# EasyEDA Pro project Quadrotor_Aircraft.eprj

# Schematic Schematic1
Create Date: 2024-07-05; Page Name: P1; Project Name: Quadrotor_Aircraft; Schematic Name: Schematic1; Update Date: 2024-07-08; Company: 嘉立创EDA; Page Size: A4; Version: V1.0
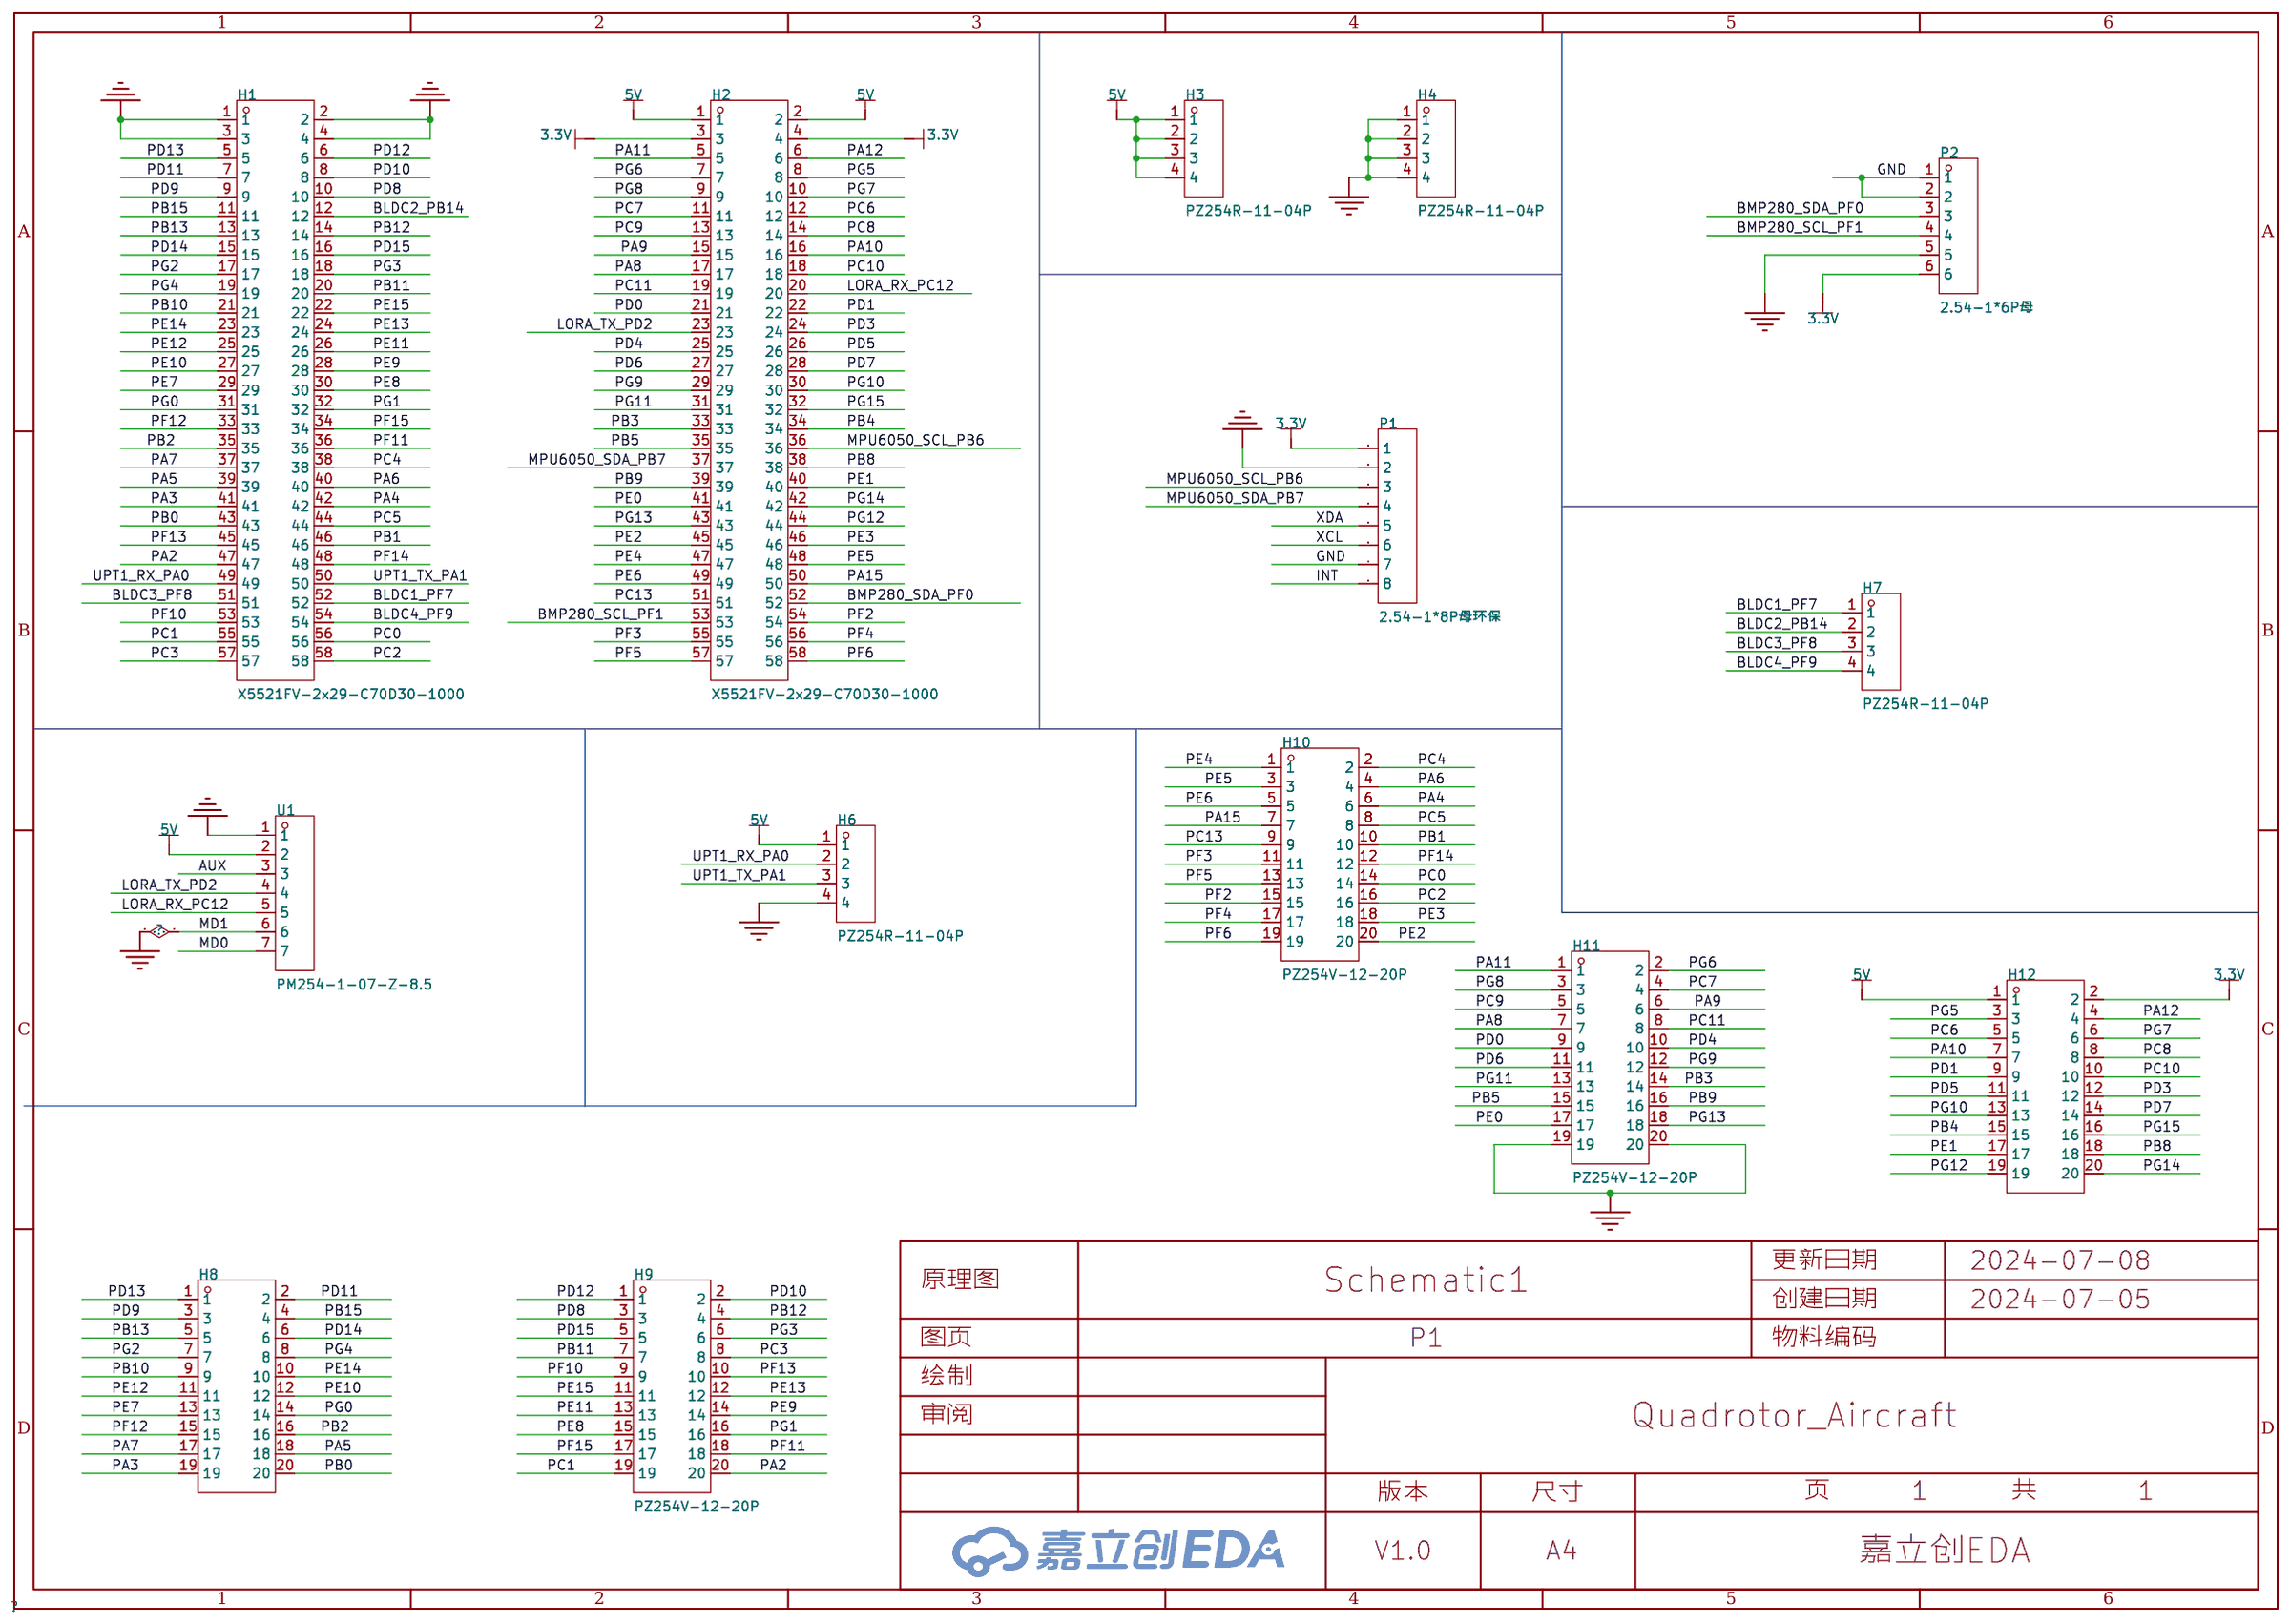
[diagram p0: schematic sheet]

## Parts
H1  X5521FV-2x29-C70D30-1000  [HDR-TH_58P-P2.54-V-F-R2-C29-S2.54]
H2  X5521FV-2x29-C70D30-1000  [HDR-TH_58P-P2.54-V-F-R2-C29-S2.54]
H3  PZ254R-11-04P  [HDR-TH_4P-P2.54-H-M-W10.4]
H4  PZ254R-11-04P  [HDR-TH_4P-P2.54-H-M-W10.4]
H6  PZ254R-11-04P  [HDR-TH_4P-P2.54-H-M-W10.4]
H7  PZ254R-11-04P  [HDR-TH_4P-P2.54-H-M-W10.4]
H8  PZ254V-12-20P  [HDR-TH_20P-P2.54-V-M-R2-C10-S2.54]
H9  PZ254V-12-20P  [HDR-TH_20P-P2.54-V-M-R2-C10-S2.54]
H10  PZ254V-12-20P  [HDR-TH_20P-P2.54-V-M-R2-C10-S2.54]
H11  PZ254V-12-20P  [HDR-TH_20P-P2.54-V-M-R2-C10-S2.54]
H12  PZ254V-12-20P  [HDR-TH_20P-P2.54-V-M-R2-C10-S2.54]
P1  2.54-1*8P母环保  [HDR-TH_8P-P2.54-V-F-1]
P2  2.54-1*6P母  [HDR-TH_6P-P2.54-V-F]
U1  PM254-1-07-Z-8.5  [HDR-TH_7P-P2.54-V-F]

## Library data of the parts
H1 H2 = X5521FV-2x29-C70D30-1000: 插孔结构:2x29P;间距:2.54mm;行距:2.54mm;圆孔/方孔:圆孔;安装类型:直插;排数:双排;总孔位数:58P;额定电流:3A;额定电压:-;插孔方向:顶部;塑高:7mm;触头材质:黄铜;触头镀层:金;工作温度范围:-40℃~+105℃;焊接温度(最大值):260℃;; LCSC Part Name: 间距:2.54mm 2x29P 直插; Supplier Part: C2682213; Manufacturer: XKB Connectivity(中国星坤); Supplier Footprint: 插件,P=2.54mm; JLCPCB Part Class: 扩展库; Datasheet: https://atta.szlcsc.com/upload/public/pdf/source/20210108/C2682197_06F7869BD6CE28D3571C9D5993C38392.pdf; Supplier: LCSC; Holes Structure: 2x29P; Pitch: 2.54mm; Row Spacing: 2.54mm; Circular Hole / Square Hole: 圆孔; Mounting Type: 直插; Number of Rows: 双排; Number of Holes: 58P; Current Rating (Max): 3A; Holes Direction: 顶部; Insulation Height: 7mm; Contact Material: 黄铜; Contact Plating: 金; Operating Temperature Range: -40℃~+105℃; Soldering Temperature(Max): 260℃
H3 H4 H6 H7 = PZ254R-11-04P: 插针结构:1x4P;间距:2.54mm;行距:-;圆针/方针:方针;安装类型:弯插;排数:单排;总PIN位数:4P;额定电流:-;额定电压:-;配合针长度:6mm;塑高:2.5mm;触头材质:黄铜;触头镀层:-;工作温度范围:-40℃~+105℃;颜色:黑色;; LCSC Part Name: 间距:2.54mm 1x4P 弯插 方针; Supplier Part: C492412; Manufacturer: XFCN(兴飞); Supplier Footprint: 弯插,P=2.54mm; JLCPCB Part Class: 扩展库; Datasheet: https://atta.szlcsc.com/upload/public/pdf/source/20200309/C492412_B0EFFC1946AB079B8871416C4A09EF6C.pdf; Supplier: LCSC; Pin Structure: 1x4P; Pitch: 2.54mm; Circluar Pins/Square Pins: 方针; Mounting Type: 弯插; Number of Rows: 单排; Number of Pins: 4P; Length of Mating Pin: 6mm; Insulation Height: 2.5mm; Contact Material: 黄铜; Operating Temperature Range: -40℃~+105℃; Color: 黑色
H8-H12 = PZ254V-12-20P: 插针结构:2x10P;间距:2.54mm;行距:2.54mm;圆针/方针:方针;安装类型:直插;排数:双排;总PIN位数:20P;额定电流:-;额定电压:-;配合针长度:6mm;塑高:2.5mm;端接针长度:3mm;触头材质:黄铜;触头镀层:-;工作温度范围:-40℃~+105℃;颜色:黑色;; LCSC Part Name: 间距:2.54mm 2x10P 直插 方针; Supplier Part: C492427; Manufacturer: XFCN(兴飞); Supplier Footprint: 插件,P=2.54mm; JLCPCB Part Class: 扩展库; Datasheet: https://atta.szlcsc.com/upload/public/pdf/source/20200309/C492427_9411E93D35F2EC20CED9A3ED9F4BBE60.pdf; Supplier: LCSC; Pin Structure: 2x10P; Pitch: 2.54mm; Row Spacing: 2.54mm; Circluar Pins/Square Pins: 方针; Mounting Type: 直插; Number of Rows: 双排; Number of Pins: 20P; Length of Mating Pin: 6mm; Insulation Height: 2.5mm; Length of End Connection Pin: 3mm; Contact Material: 黄铜; Operating Temperature Range: -40℃~+105℃; Color: 黑色
P1 = 2.54-1*8P母环保: 插孔结构:1x8P;间距:2.54mm;行距:-;安装类型:直插;排数:单排;总孔位数:8P;塑高:-;触头材质:-;触头镀层:-;; LCSC Part Name: 间距:2.54mm 1x8P 直插; Supplier Part: C27438; Manufacturer: BOOMELE(博穆精密); Supplier Footprint: 插件,P=2.54mm; JLCPCB Part Class: 扩展库; Datasheet: https://atta.szlcsc.com/upload/public/pdf/source/20231221/1CA800C6799ED97958773716FAA1BFFE.pdf; Supplier: LCSC; Holes Structure: 1x8P; Pitch: 2.54mm; Mounting Type: 直插; Number of Rows: 单排; Number of Holes: 8P
P2 = 2.54-1*6P母: 插孔结构:1x6P;间距:2.54mm;行距:-;安装类型:直插;排数:单排;总孔位数:6P;塑高:-;触头材质:-;触头镀层:-;; LCSC Part Name: 间距:2.54mm 1x6P 直插; Supplier Part: C40877; Manufacturer: BOOMELE(博穆精密); Supplier Footprint: 插件,P=2.54mm; JLCPCB Part Class: 扩展库; Datasheet: https://atta.szlcsc.com/upload/public/pdf/source/20210301/C2718488_F4427B881E42CAA8DDB0B1C12B3A522C.pdf; Supplier: LCSC; Holes Structure: 1x6P; Pitch: 2.54mm; Mounting Type: 直插; Number of Rows: 单排; Number of Holes: 6P
U1 = PM254-1-07-Z-8.5: 插孔结构:1x7P;间距:2.54mm;行距:-;圆孔/方孔:方孔;安装类型:直插;排数:单排;总孔位数:7P;额定电流:3A;额定电压:-;插孔方向:顶部;塑高:8.5mm;触头材质:铜合金;工作温度范围:-40℃~+105℃;焊接温度(最大值):260℃@5S;; LCSC Part Name: 1x7P 间距:2.54mm 直插; Supplier Part: C2897370; Manufacturer: HCTL(华灿天禄); Supplier Footprint: 插件,P=2.54mm; JLCPCB Part Class: 扩展库; Datasheet: https://atta.szlcsc.com/upload/public/pdf/source/20230609/534BE42964C679BDE98E061007C4ABD6.pdf; Supplier: LCSC; Holes Structure: 1x7P; Pitch: 2.54mm; Circular Hole / Square Hole: 方孔; Mounting Type: 直插; Number of Rows: 单排; Number of Holes: 7P; Current Rating (Max): 3A; Holes Direction: 顶部; Insulation Height: 8.5mm; Contact Material: 铜合金; Operating Temperature Range: -40℃~+105℃; Soldering Temperature(Max): 260℃@5S

## Nets
3.3V: H2.3 H2.4 H12.2 P1.1 P2.6
5V: H2.1 H2.2 H3.1 H3.2 H3.3 H3.4 H6.1 H12.1 U1.2
GND: H1.1 H1.2 H1.3 H1.4 H4.1 H4.2 H4.3 H4.4 H6.4 H11.19 H11.20 P1.2 P1.7 P2.1 P2.2 P2.5 U1.1 U1.6
AUX: U1.3
BLDC1_PF7: H1.52 H7.1
BLDC2_PB14: H1.12 H7.2
BLDC3_PF8: H1.51 H7.3
BLDC4_PF9: H1.54 H7.4
BMP280_SCL_PF1: H2.53 P2.4
BMP280_SDA_PF0: H2.52 P2.3
INT: P1.8
LORA_RX_PC12: H2.20 U1.5
LORA_TX_PD2: H2.23 U1.4
MD0: U1.7
MPU6050_SCL_PB6: H2.36 P1.3
MPU6050_SDA_PB7: H2.37 P1.4
PA2: H1.47 H9.20
PA3: H1.41 H8.19
PA4: H1.42 H10.6
PA5: H1.39 H8.18
PA6: H1.40 H10.4
PA7: H1.37 H8.17
PA8: H2.17 H11.7
PA9: H2.15 H11.6
PA10: H2.16 H12.7
PA11: H2.5 H11.1
PA12: H2.6 H12.4
PA15: H2.50 H10.7
PB0: H1.43 H8.20
PB1: H1.46 H10.10
PB2: H1.35 H8.16
PB3: H2.33 H11.14
PB4: H2.34 H12.15
PB5: H2.35 H11.15
PB8: H2.38 H12.18
PB9: H2.39 H11.16
PB10: H1.21 H8.9
PB11: H1.20 H9.7
PB12: H1.14 H9.4
PB13: H1.13 H8.5
PB15: H1.11 H8.4
PC0: H1.56 H10.14
PC1: H1.55 H9.19
PC2: H1.58 H10.16
PC3: H1.57 H9.8
PC4: H1.38 H10.2
PC5: H1.44 H10.8
PC6: H2.12 H12.5
PC7: H2.11 H11.4
PC8: H2.14 H12.8
PC9: H2.13 H11.5
PC10: H2.18 H12.10
PC11: H2.19 H11.8
PC13: H2.51 H10.9
PD0: H2.21 H11.9
PD1: H2.22 H12.9
PD3: H2.24 H12.12
PD4: H2.25 H11.10
PD5: H2.26 H12.11
PD6: H2.27 H11.11
PD7: H2.28 H12.14
PD8: H1.10 H9.3
PD9: H1.9 H8.3
PD10: H1.8 H9.2
PD11: H1.7 H8.2
PD12: H1.6 H9.1
PD13: H1.5 H8.1
PD14: H1.15 H8.6
PD15: H1.16 H9.5
PE0: H2.41 H11.17
PE1: H2.40 H12.17
PE2: H2.45 H10.20
PE3: H2.46 H10.18
PE4: H2.47 H10.1
PE5: H2.48 H10.3
PE6: H2.49 H10.5
PE7: H1.29 H8.13
PE8: H1.30 H9.15
PE9: H1.28 H9.14
PE10: H1.27 H8.12
PE11: H1.26 H9.13
PE12: H1.25 H8.11
PE13: H1.24 H9.12
PE14: H1.23 H8.10
PE15: H1.22 H9.11
PF2: H2.54 H10.15
PF3: H2.55 H10.11
PF4: H2.56 H10.17
PF5: H2.57 H10.13
PF6: H2.58 H10.19
PF10: H1.53 H9.9
PF11: H1.36 H9.18
PF12: H1.33 H8.15
PF13: H1.45 H9.10
PF14: H1.48 H10.12
PF15: H1.34 H9.17
PG0: H1.31 H8.14
PG1: H1.32 H9.16
PG2: H1.17 H8.7
PG3: H1.18 H9.6
PG4: H1.19 H8.8
PG5: H2.8 H12.3
PG6: H2.7 H11.2
PG7: H2.10 H12.6
PG8: H2.9 H11.3
PG9: H2.29 H11.12
PG10: H2.30 H12.13
PG11: H2.31 H11.13
PG12: H2.44 H12.19
PG13: H2.43 H11.18
PG14: H2.42 H12.20
PG15: H2.32 H12.16
UPT1_RX_PA0: H1.49 H6.2
UPT1_TX_PA1: H1.50 H6.3
XCL: P1.6
XDA: P1.5

# Board PCB1
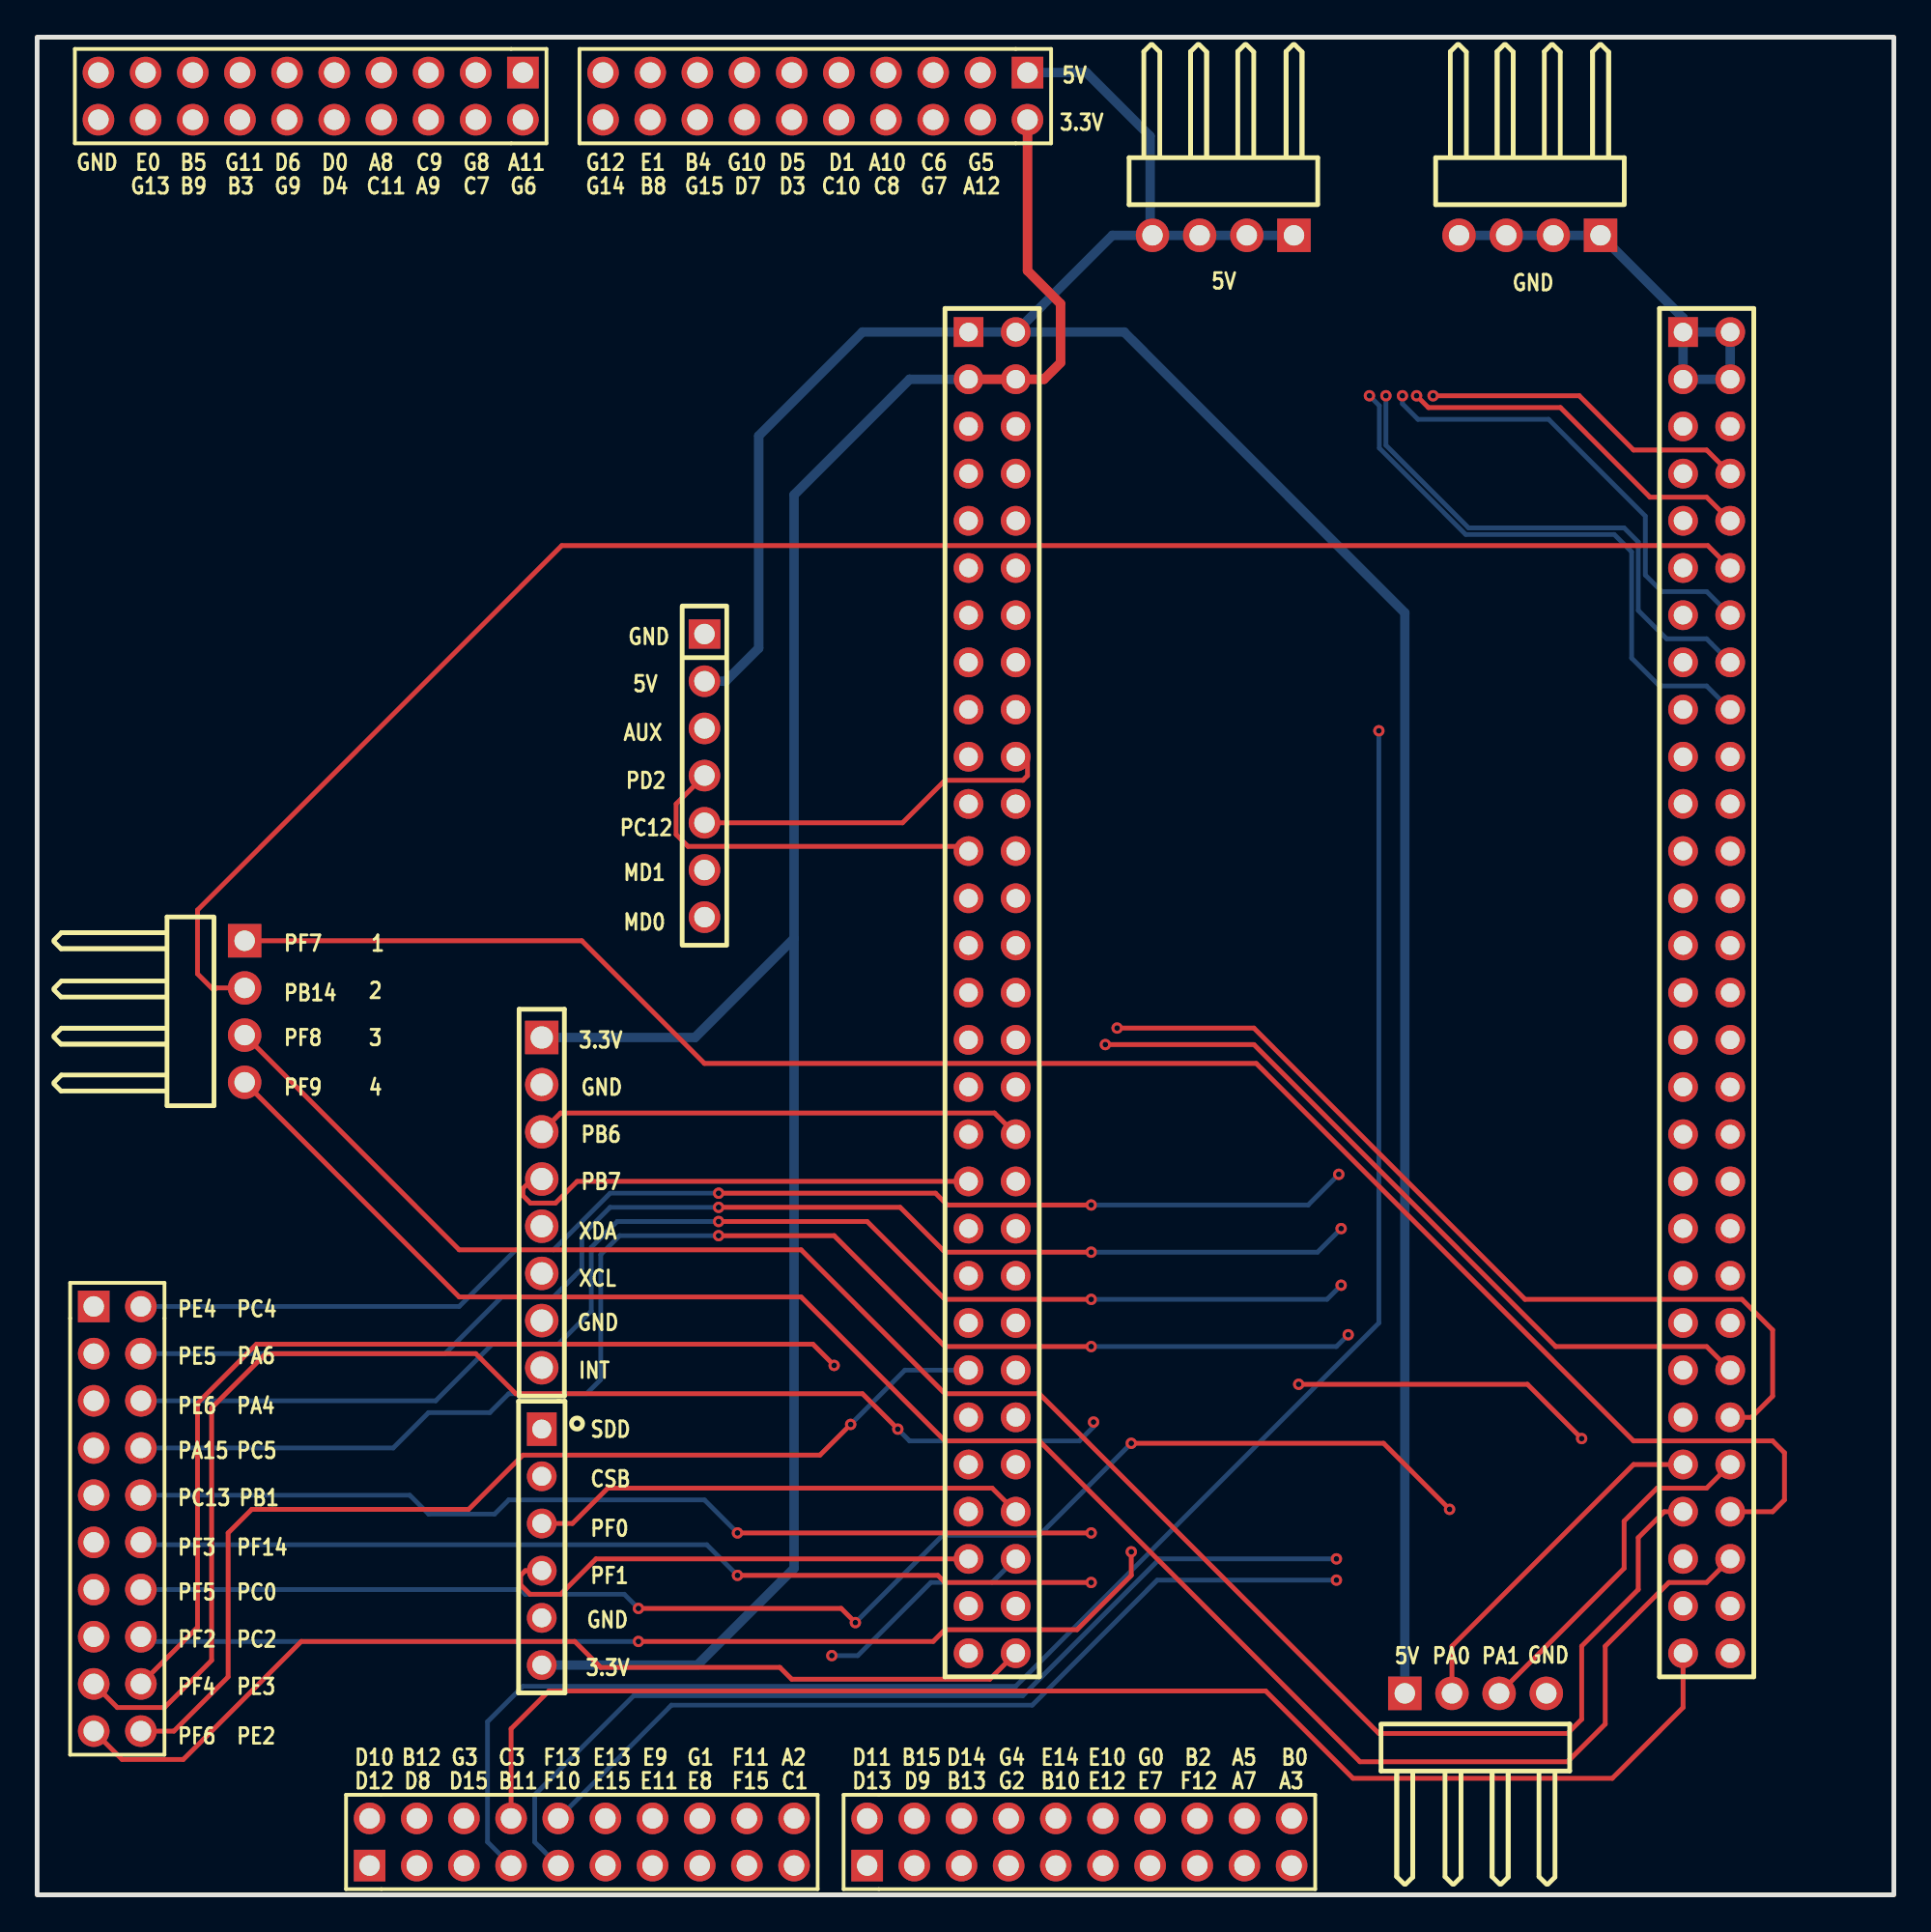
[diagram p1: board, top side]
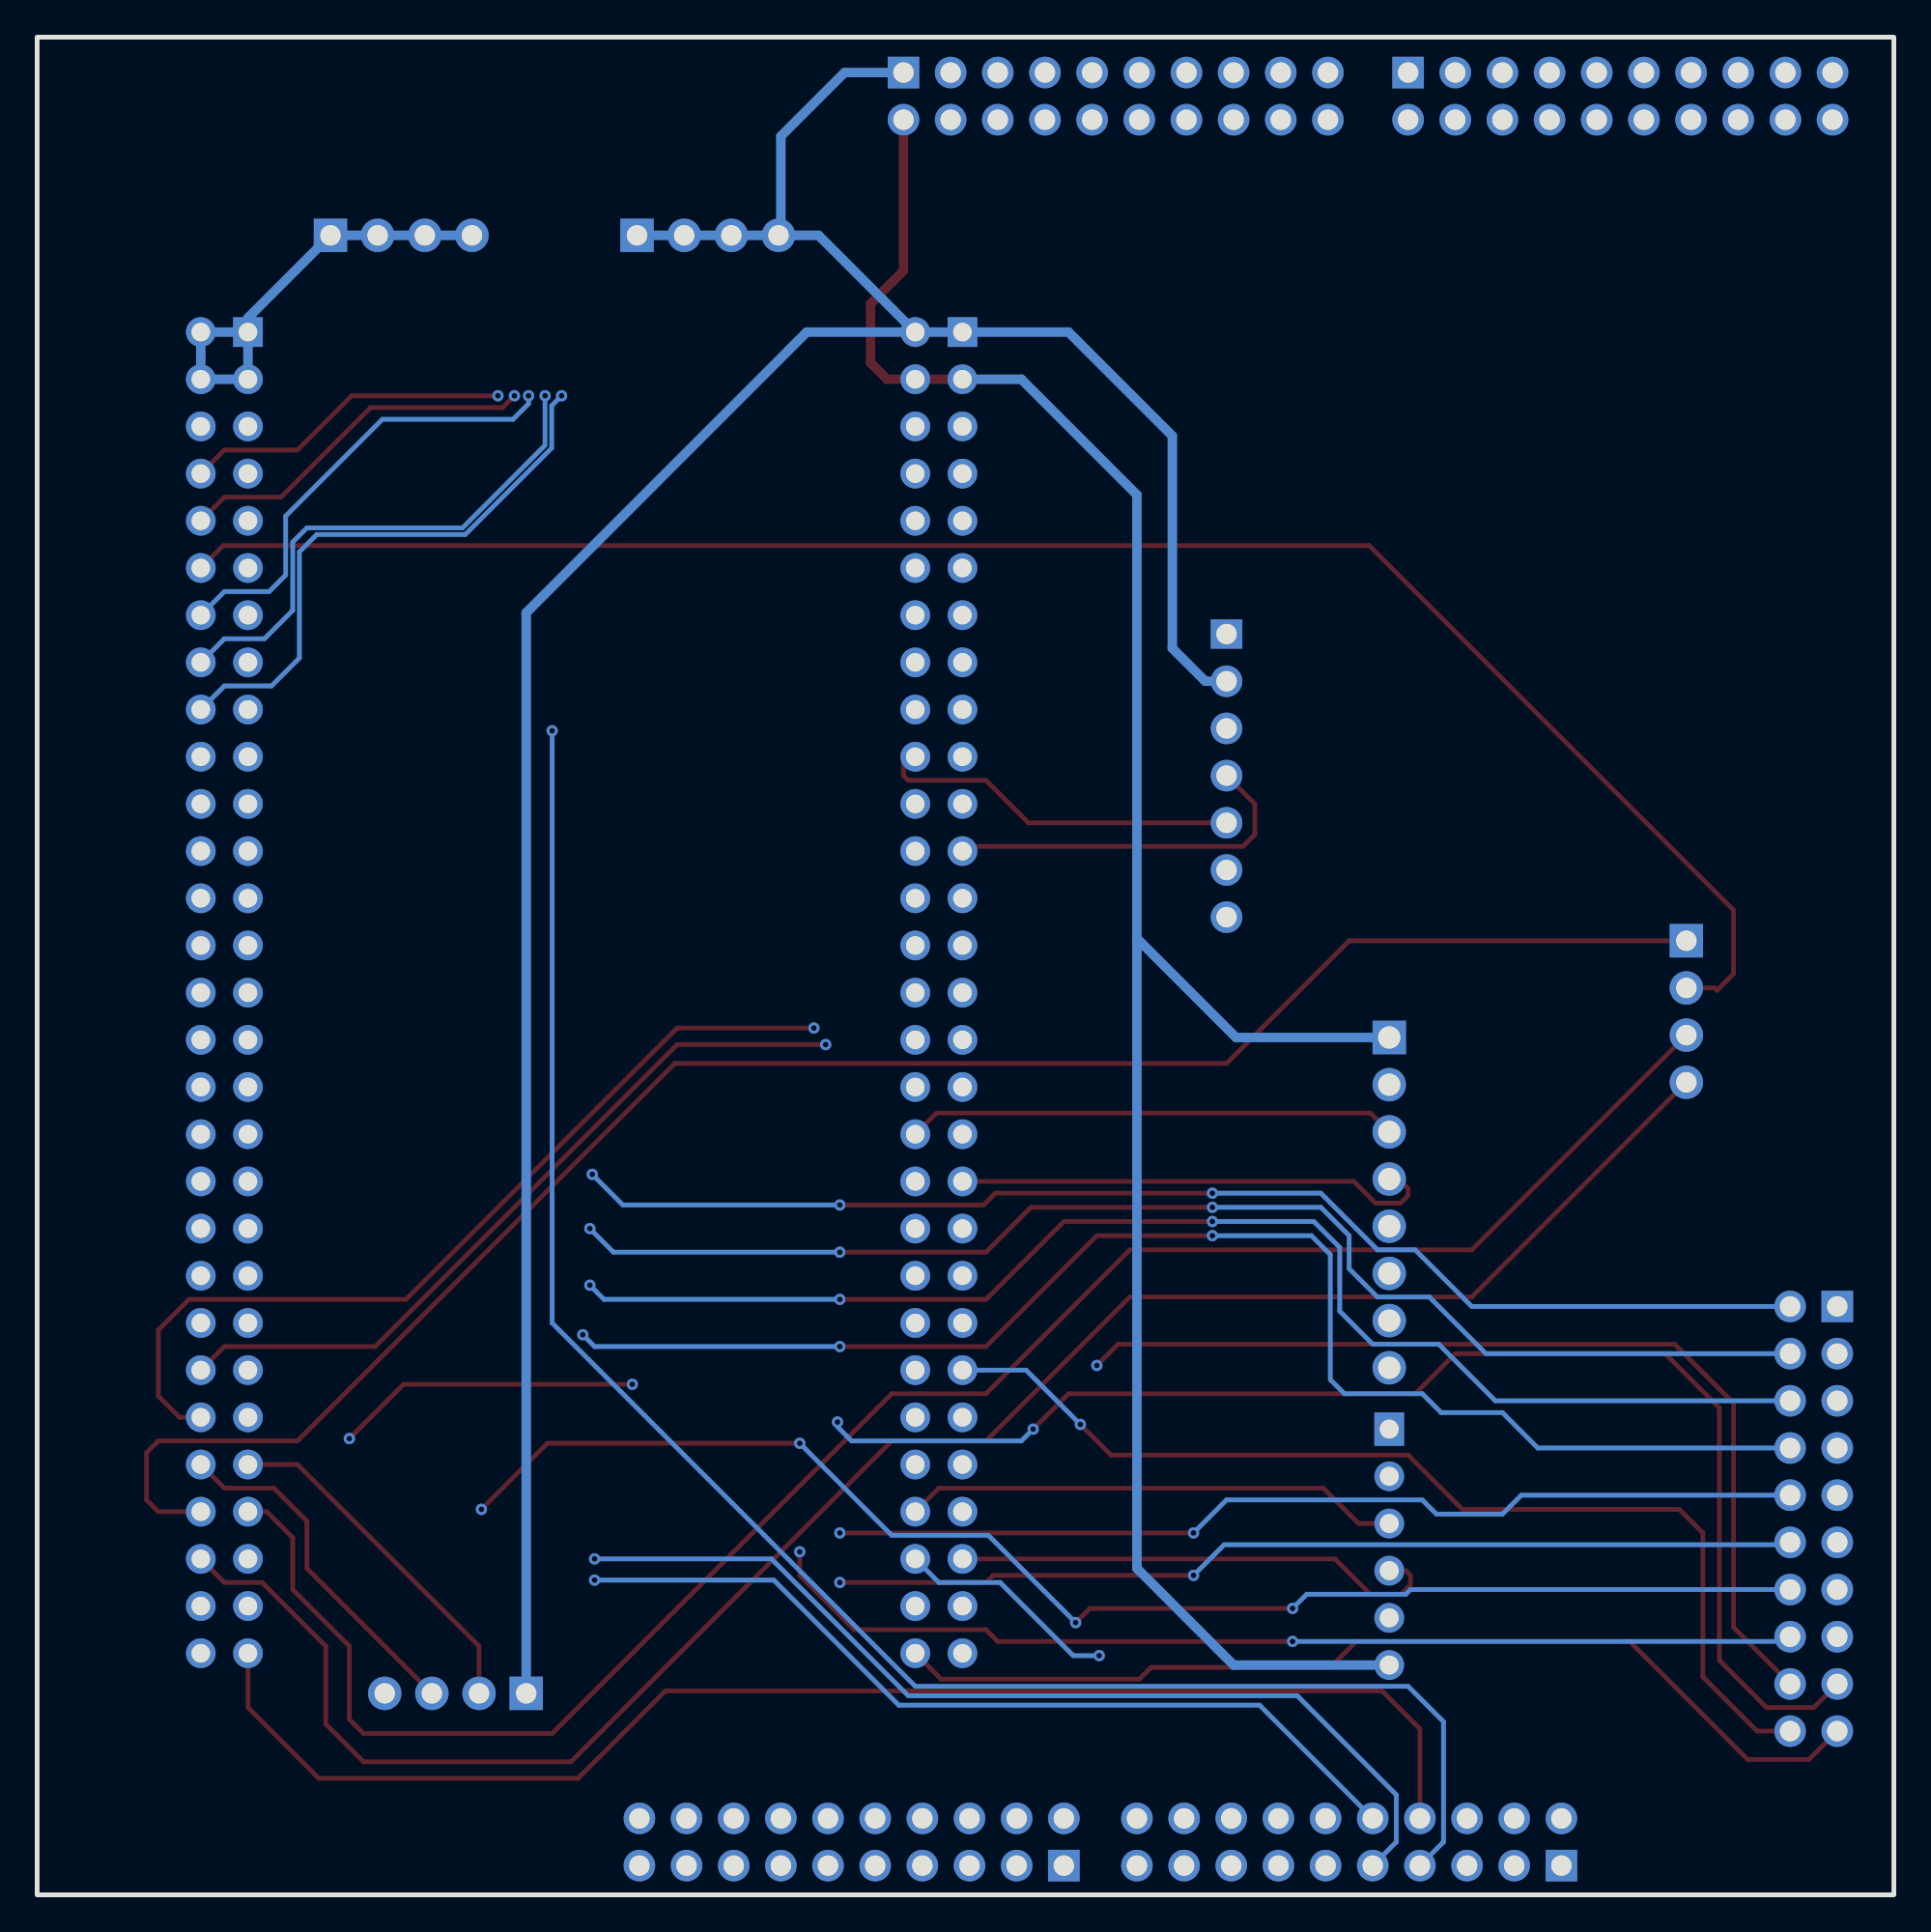
[diagram p2: board, bottom side, seen from below]

Outline 100 x 100 mm; copper layers: Top Layer, Inner1, Inner2, Bottom Layer. Coordinates in mm from the lower left corner of the outline.
Outline path: rectangle 0,100 100,0
Stack: Top Layer 0.035mm 外层铜厚1oz / Dielectric1 0.2104mm 7628 RC49% 8.6mil / Inner1 0.0152mm 内层铜厚 / Dielectric2 1.065mm 1.1mm H/HOZ 含铜 / Inner2 0.0152mm 内层铜厚 / Dielectric3 0.2104mm 7628 RC49% 8.6mil / Bottom Layer 0.035mm 外层铜厚1oz

## Design rules (mm)
net BMP280_SCL_PF1: DP2
net BMP280_SDA_PF0: DP2
net MPU6050_SDA_PB7: DP1
net MPU6050_SCL_PB6: DP1
net UPT1_TX_PA1: DP3
net UPT1_RX_PA0: DP3
net LORA_TX_PD2: DP4
net LORA_RX_PC12: DP4
template: JLCPCB Capability(Two Layers Board)
spacing copperThickness1oz (default): track to track 0.102, other pairs 0.152 to 0.3
spacing copperThickness2oz: track to track 0.203, other pairs 0.152 to 0.3
track width copperThickness1oz (default): min 0.127, default 0.254, max 2.54
track width copperThickness2oz: min 0.203, default 0.254, max 2.54
differential pair differentialPair (default): width min 0.127, default 0.254, max 2.54; gap min 0.152, default 0.152
via viaSize (default): diameter min 0.5, default 0.61, max 10; hole min 0.3, default 0.305, max 6.3

## Placement (name value [footprint] x y rotation side)
H1  X5521FV-2x29-C70D30-1000  [HDR-TH_58P-P2.54-V-F-R2-C29-S2.54]  89.92 48.56 270 top
H2  X5521FV-2x29-C70D30-1000  [HDR-TH_58P-P2.54-V-F-R2-C29-S2.54]  51.43 48.56 270 top
H3  PZ254R-11-04P  [HDR-TH_4P-P2.54-H-M-W10.4]  63.88 89.33 180 top
H4  PZ254R-11-04P  [HDR-TH_4P-P2.54-H-M-W10.4]  80.39 89.33 180 top
H6  PZ254R-11-04P  [HDR-TH_4P-P2.54-H-M-W10.4]  77.47 10.85 0 top
H7  PZ254R-11-04P  [HDR-TH_4P-P2.54-H-M-W10.4]  11.18 47.55 270 top
H8  PZ254V-12-20P  [HDR-TH_20P-P2.54-V-M-R2-C10-S2.54]  56.13 2.84 0 top
H9  PZ254V-12-20P  [HDR-TH_20P-P2.54-V-M-R2-C10-S2.54]  29.34 2.84 0 top
H10  PZ254V-12-20P  [HDR-TH_20P-P2.54-V-M-R2-C10-S2.54]  4.32 20.24 270 top
H11  PZ254V-12-20P  [HDR-TH_20P-P2.54-V-M-R2-C10-S2.54]  14.73 96.83 180 top
H12  PZ254V-12-20P  [HDR-TH_20P-P2.54-V-M-R2-C10-S2.54]  41.91 96.83 180 top
P1  2.54-1*8P母环保  [HDR-TH_8P-P2.54-V-F-1]  27.18 37.26 270 top
P2  2.54-1*6P母  [HDR-TH_6P-P2.54-V-F]  27.18 18.72 270 top
U1  PM254-1-07-Z-8.5  [HDR-TH_7P-P2.54-V-F]  35.94 60.25 270 top

## Footprints (pads in the part's own frame, mm; a bottom-side part is the same pattern mirrored in y, then rotated)
HDR-TH_4P-P2.54-H-M-W10.4
  rect 1.8x1.8 hole 1.1: 1(-3.81,0)
  round 1.8 hole 1.1: 2(-1.27,0) 3(1.27,0) 4(3.81,0)
HDR-TH_6P-P2.54-V-F
  rect 1.8x1.6 hole 1.02: 1(-6.35,0)
  round 1.6 hole 1.02: 2(-3.81,0) 3(-1.27,0) 4(1.27,0) 5(3.81,0) 6(6.35,0)
HDR-TH_7P-P2.54-V-F
  rect 1.575x1.7 hole 1.1: 1(-7.62,0)
  round 1.7 hole 1.1: 2(-5.08,0) 3(-2.54,0) 4(0,0) 5(2.54,0) 6(5.08,0) 7(7.62,0)
HDR-TH_8P-P2.54-V-F-1
  rect 1.8x1.8 hole 1.2: 1(-8.89,0)
  round 1.8 hole 1.2: 2(-6.35,0) 3(-3.81,0) 4(-1.27,0) 5(1.27,0) 6(3.81,0) 7(6.35,0) 8(8.89,0)
HDR-TH_20P-P2.54-V-M-R2-C10-S2.54
  rect 1.7x1.7 hole 1.1: 1(-11.43,-1.27)
  round 1.7 hole 1.1: 2(-11.43,1.27) 3(-8.89,-1.27) 4(-8.89,1.27) 5(-6.35,-1.27) 6(-6.35,1.27) 7(-3.81,-1.27) 8(-3.81,1.27) 9(-1.27,-1.27) 10(-1.27,1.27) 11(1.27,-1.27) 12(1.27,1.27) 13(3.81,-1.27) 14(3.81,1.27) 15(6.35,-1.27) 16(6.35,1.27) 17(8.89,-1.27) 18(8.89,1.27) 19(11.43,-1.27) 20(11.43,1.27)
HDR-TH_58P-P2.54-V-F-R2-C29-S2.54
  rect 1.6x1.6 hole 1: 1(-35.56,-1.27)
  round 1.6 hole 1: 2(-35.56,1.27) 3(-33.02,-1.27) 4(-33.02,1.27) 5(-30.48,-1.27) 6(-30.48,1.27) 7(-27.94,-1.27) 8(-27.94,1.27) 9(-25.4,-1.27) 10(-25.4,1.27) 11(-22.86,-1.27) 12(-22.86,1.27) 13(-20.32,-1.27) 14(-20.32,1.27) 15(-17.78,-1.27) 16(-17.78,1.27) 17(-15.24,-1.27) 18(-15.24,1.27) 19(-12.7,-1.27) 20(-12.7,1.27) 21(-10.16,-1.27) 22(-10.16,1.27) 23(-7.62,-1.27) 24(-7.62,1.27) 25(-5.08,-1.27) 26(-5.08,1.27) 27(-2.54,-1.27) 28(-2.54,1.27) 29(0,-1.27) 30(0,1.27) 31(2.54,-1.27) 32(2.54,1.27) 33(5.08,-1.27) 34(5.08,1.27) 35(7.62,-1.27) 36(7.62,1.27) 37(10.16,-1.27) 38(10.16,1.27) 39(12.7,-1.27) 40(12.7,1.27) 41(15.24,-1.27) 42(15.24,1.27) 43(17.78,-1.27) 44(17.78,1.27) 45(20.32,-1.27) 46(20.32,1.27) 47(22.86,-1.27) 48(22.86,1.27) 49(25.4,-1.27) 50(25.4,1.27) 51(27.94,-1.27) 52(27.94,1.27) 53(30.48,-1.27) 54(30.48,1.27) 55(33.02,-1.27) 56(33.02,1.27) 57(35.56,-1.27) 58(35.56,1.27)

## Nets
As in the schematic.

## Via types
v1: diameter 0.61, hole 0.305, Top Layer to Bottom Layer, 39 vias

## Routing (per net, layer and track width the routed paths; a pad name or vN(x,y) marks a point on that pad's centre or on a via; arc(x,y) is an arc through that point)
3.3V: length 120.4
  Top Layer w0.508: H2.3 H2.4 54.23,81.59 55.12,82.47 55.12,85.65 53.34,87.43 H12.2
  Bottom Layer w0.508: P1.1 35.43,46.15 40.77,51.49 ; 40.77,51.49 40.77,75.36 46.99,81.59 H2.3 ; 40.77,51.49 40.77,17.58 35.56,12.37 P2.6
5V: length 147.2
  Bottom Layer w0.508: H2.2 H2.1 44.45,84.12 38.86,78.54 38.86,67.11 37.08,65.33 35.94,65.33 ; H2.2 57.91,89.33 H3.1 ; H2.2 58.55,84.12 73.66,69.01 H6.1 ; 53.34,98.09 56.52,98.09 59.94,94.67 59.94,89.46 H3.4
BLDC3_PF8: length 101.9
  Top Layer w0.254: 11.18,46.28 22.73,34.72 41.15,34.72 48.89,26.97 53.98,26.97 72.26,8.69 82.42,8.69 83.18,9.45 83.18,13.39 86.23,16.43 86.23,19.23 87.63,20.62 H1.51
BLDC4_PF9: length 102.1
  Top Layer w0.254: 91.19,18.09 89.92,16.81 87.88,16.81 84.45,13.39 84.45,9.19 82.42,7.16 71.25,7.16 53.98,24.44 48.89,24.44 41.15,32.18 22.73,32.18 H7.4
BMP280_SCL_PF1: length 26.9
  Top Layer w0.254: P2.4 26.29,17.45 26.03,17.2 26.03,16.69 26.54,16.18 28.19,16.18 30.1,18.09 H2.53
BMP280_SDA_PF0: length 26.8
  Top Layer w0.254: H2.52 51.43,21.9 30.73,21.9 28.83,19.99 P2.3
LORA_RX_PC12: length 20
  Top Layer w0.254: 35.94,57.71 46.61,57.71 48.89,60 53.09,60 53.34,60.25 53.34,61.01 53.09,61.27 H2.20
LORA_TX_PD2: length 19.9
  Top Layer w0.254: H2.23 49.91,56.44 35.05,56.44 34.42,57.07 34.42,58.73 U1.4
MPU6050_SCL_PB6: length 26.4
  Top Layer w0.254: 52.7,40.95 51.56,42.09 28.19,42.09 P1.3
MPU6050_SDA_PB7: length 26.3
  Top Layer w0.254: H2.37 29.08,38.41 27.92,37.24 26.57,37.24 26.16,37.64 26.16,38.02 26.67,38.53 P1.4
PA2: length 72.5
  Inner2 w0.254: 88.65,25.71 88.65,25.58 89.79,24.44 92.08,24.44 93.35,23.16 93.35,15.16 92.46,14.28 64.01,14.28 58.01,8.28 42.26,8.28 40.77,6.78 H9.20
PA3: length 50.9
  Inner1 w0.254: H8.19 66.29,2.84 66.29,14.78 66.8,15.29 66.8,27.48 72.64,33.33 H1.41
PA4: length 94.9
  Top Layer w0.254: v1(56.77,32.06) 48.89,32.06 44.7,36.25 v1(36.7,36.25)
  Inner1 w0.254: 91.19,33.33 89.92,34.59 72.01,34.59 v1(70.23,32.82)
  Bottom Layer w0.254: v1(56.77,32.06) 69.47,32.06 v1(70.23,32.82) ; v1(36.7,36.25) 31.24,36.25 29.84,34.85 29.84,31.42 28.07,29.64 24.51,29.64 21.46,26.59 H10.6
PA5: length 51.4
  Inner1 w0.254: H8.18 65.02,14.15 66.42,15.55 66.42,30.53 71.76,35.87 88.65,35.87
PA6: length 92.5
  Top Layer w0.254: v1(56.77,34.59) 48.89,34.59 46.48,37.01 v1(36.7,37.01)
  Inner1 w0.254: v1(70.23,35.87) 71.5,37.14 89.92,37.14 91.19,35.87
  Bottom Layer w0.254: H10.4 21.97,29.13 25.02,32.18 27.81,32.18 29.34,33.71 29.34,35.48 30.86,37.01 v1(36.7,37.01) ; v1(56.77,34.59) 68.96,34.59 v1(70.23,35.87)
PA7: length 57.8
  Inner1 w0.254: H8.17 63.75,2.84 63.75,13.39 66.04,15.67 66.04,33.07 71.37,38.41 H1.37
PA8: length 47.4
  Inner1 w0.254: 18.54,98.09 19.81,96.83 19.81,94.41 50.17,64.06 50.17,63.81
PA9: length 41.9
  Inner1 w0.254: H2.15 49.15,66.34 21.08,94.41 H11.6
PA10: length 37.3
  Inner2 w0.254: 45.72,98.09 44.45,96.83 44.45,71.93 48.89,67.49 51.56,67.49 H2.16
PA11: length 36.1
  Inner1 w0.254: H2.5 48.89,80.31 37.72,80.31 28.07,89.97 28.07,97.08 27.05,98.09 26.16,98.09
PA12: length 20.1
  Inner2 w0.254: H12.4 50.8,87.3 48.89,85.39 48.89,80.82 49.4,80.31 51.43,80.31 H2.6
PA15: length 51.9
  Inner2 w0.254: H10.7 4.32,22.78 19.3,22.78 21.21,20.88 25.53,20.88 25.91,21.26 42.55,21.26 43.18,21.9 51.43,21.9 H2.50
PB0: length 44.3
  Inner1 w0.254: H1.43 73.53,30.78 67.56,24.82 H8.20
PB1: length 120.2
  Top Layer w0.254: 91.19,28.25 89.92,29.52 81.79,29.52 65.53,45.77 v1(57.53,45.77) ; v1(37.72,19.48) v1(56.77,19.48)
  Inner1 w0.254: v1(56.77,19.48) 57.53,20.24 v1(57.53,45.77)
  Bottom Layer w0.254: H10.10 20.07,21.51 21.08,20.5 24.64,20.5 25.4,21.26 35.94,21.26 v1(37.72,19.48)
PB2: length 58.2
  Inner1 w0.254: 88.65,40.95 70.61,40.95 65.66,35.99 65.66,15.8 62.48,12.62 H8.16
PB3: length 71
  Inner1 w0.254: H2.33 46.29,47.36 46.29,59.68 39.37,66.6 34.8,66.6 34.16,67.23 34.16,71.81 10.92,95.05 H11.14
PB4: length 67.4
  Inner2 w0.254: 35.56,98.09 34.29,96.83 34.29,71.17 32.39,69.27 32.39,58.6 34.54,56.44 37.34,56.44 49.02,44.75 51.43,44.75 H2.34
PB5: length 77.9
  Inner1 w0.254: 50.17,40.95 48.77,40.95 45.94,43.78 45.94,56.86 38.73,64.06 34.29,64.06 33.02,65.33 33.02,70.92 9.65,94.28 9.65,96.83 8.38,98.09
PB8: length 69.2
  Inner2 w0.254: H2.38 52.7,38.53 51.56,39.67 49.28,39.67 48.89,40.06 48.89,41.83 36.83,53.9 34.54,53.9 31.5,56.95 31.5,69.65 33.02,71.17 H12.18
PB9: length 78.3
  Inner1 w0.254: 50.17,35.87 45.58,40.45 45.58,53.15 37.21,61.52 35.05,61.52 32.64,63.93 32.64,70.79 8.38,95.05 H11.16
PB10: length 82.8
  Inner1 w0.254: H8.9 53.59,2.84 53.59,7.29 62.86,16.56 62.86,16.57 62.97,16.67 62.97,51.08 70.61,58.73 88.65,58.73
PB11: length 116.5
  Inner1 w0.254: 91.19,61.27 89.79,62.66 v1(72.26,62.66)
  Bottom Layer w0.254: H9.7 24.26,2.84 24.26,9.32 26.16,11.23 52.7,11.23 72.26,30.78 v1(72.26,62.66)
PB12: length 171.7
  Inner1 w0.254: H9.4 20.45,15.67 26.03,21.26 46.74,21.26 48.64,19.35 54.48,19.35 55.37,20.24 55.37,88.06 58.7,91.39 71.86,91.39 73.53,89.71 v1(73.53,80.7)
  Bottom Layer w0.254: 91.19,68.89 89.92,70.16 87.5,70.16 86.61,71.04 86.61,74.22 81.41,79.43 74.37,79.43 73.53,80.26 v1(73.53,80.7)
PB13: length 100.6
  Inner1 w0.254: H8.5 48.51,2.84 48.51,9.47 49.36,10.31 54.58,10.31 61.34,17.07 61.34,17.09 61.49,17.24 61.49,64.09 66.29,68.89 88.65,68.89
PB15: length 103.8
  Inner1 w0.254: H1.11 87.07,73 64.72,73 61.14,69.42 61.14,17.39 61.09,17.35 61.09,17.34 54.42,10.67 54.31,10.67 54.3,10.67 49.21,10.67 47.24,8.7 H8.4
PC0: length 94
  Top Layer w0.254: v1(32.39,15.42) 43.31,15.42 v1(44.07,14.66) ; v1(76.07,20.75) 72.52,24.31 v1(58.93,24.31)
  Inner1 w0.254: 91.19,15.55 89.92,16.81 86.49,16.81 82.55,20.75 v1(76.07,20.75)
  Bottom Layer w0.254: H10.14 26.03,16.43 26.29,16.18 31.62,16.18 v1(32.39,15.42) ; v1(44.07,14.66) 48.77,19.35 53.98,19.35 v1(58.93,24.31)
PC1: length 58.8
  Inner2 w0.254: H9.19 39.5,2.84 39.5,7.29 40.84,8.63 57.86,8.63 64.77,15.55 88.65,15.55
PC2: length 107
  Top Layer w0.254: v1(32.39,13.64) 48.26,13.64 48.89,14.28 56.01,14.28 58.93,17.2 v1(58.93,18.47) ; v1(83.18,24.56) 80.26,27.48 v1(67.95,27.48)
  Inner1 w0.254: v1(83.18,24.56) 86.49,21.26 86.49,19.99 87.12,19.35 92.84,19.35 94.11,18.09 94.11,14.28 92.84,13 91.19,13
  Inner2 w0.254: v1(58.93,18.47) v1(67.95,27.48)
  Bottom Layer w0.254: H10.16 5.84,13.64 v1(32.39,13.64)
PC3: length 75.2
  Top Layer w0.254: H1.57 88.65,10.08 84.84,6.27 70.87,6.27 66.17,10.97 27.56,10.97 25.53,8.94 H9.8
PC4: length 90
  Top Layer w0.254: v1(56.77,37.14) 49.02,37.14 48.39,37.77 v1(36.7,37.77)
  Inner1 w0.254: v1(70.1,38.79) 70.99,39.67 89.92,39.67 91.19,38.41
  Bottom Layer w0.254: v1(56.77,37.14) 68.45,37.14 v1(70.1,38.79) ; H10.2 22.73,31.67 25.78,34.72 27.81,34.72 30.86,37.77 v1(36.7,37.77)
PC5: length 98.3
  Top Layer w0.254: v1(56.77,29.52) 48.89,29.52 42.93,35.48 v1(36.7,35.48)
  Inner1 w0.254: 91.19,30.78 89.92,32.06 73.41,32.06 71.5,30.15 v1(70.61,30.15)
  Bottom Layer w0.254: v1(70.61,30.15) 69.98,29.52 v1(56.77,29.52) ; H10.8 19.18,24.05 21.08,25.96 24.38,25.96 25.4,26.97 29.59,26.97 30.35,27.74 30.35,34.47 31.37,35.48 v1(36.7,35.48)
PC6: length 31.1
  Inner2 w0.254: 48.26,98.09 46.99,96.83 46.99,74.6 48.89,72.7 51.43,72.7 H2.12
PC7: length 38.1
  Inner1 w0.254: H2.11 45.08,71.42 23.62,92.89 H11.4
PC8: length 31.1
  Inner2 w0.254: H12.8 45.72,73.33 48.89,70.16 51.43,70.16 52.7,68.89
PC9: length 43
  Inner1 w0.254: 21.08,98.09 22.35,96.83 22.35,93.65 47.12,68.89 50.17,68.89
PC10: length 37.2
  Inner2 w0.254: H12.10 43.18,70.79 48.89,65.08 51.43,65.08 52.7,63.81
PC11: length 47.5
  Inner1 w0.254: H11.8 18.54,95.17 48.77,64.95 48.77,62.53 50.04,61.27 H2.19
PC13: length 49.1
  Inner2 w0.254: H2.51 50.04,20.75 30.35,20.75 28.45,18.85 25.02,18.85 23.62,20.24 4.32,20.24 H10.9
PD0: length 53.5
  Inner1 w0.254: 50.17,58.73 48.39,60.5 48.39,63.3 17.27,94.41 17.27,96.83 16,98.09
PD1: length 45.9
  Inner2 w0.254: 43.18,98.09 41.91,96.83 41.91,66.98 48.89,60 51.43,60 52.7,58.73
PD3: length 45.9
  Inner2 w0.254: H12.12 40.64,65.71 48.89,57.45 51.43,57.45 H2.24
PD4: length 56.1
  Inner1 w0.254: H11.10 16,95.17 48.01,63.17 48.01,55.8 H2.25
PD5: length 52
  Inner2 w0.254: H2.26 51.43,54.92 48.89,54.92 39.37,64.44 39.37,96.83 40.64,98.09
PD6: length 62.5
  Inner1 w0.254: H2.27 49.66,51.11 47.62,53.14 47.62,61.39 14.73,94.28 14.73,96.83 13.46,98.09
PD7: length 52
  Inner2 w0.254: H2.28 51.43,52.38 48.89,52.38 38.1,63.17 H12.14
PD8: length 171.6
  Top Layer w0.254: 91.19,73.97 89.92,75.23 86.87,75.23 82.04,80.06 74.93,80.06 v1(74.3,80.7)
  Inner1 w0.254: v1(74.3,80.7) 74.3,90.73 73.28,91.75 58.42,91.75 54.99,88.32 54.99,23.29 53.59,21.9 46.86,21.9 45.08,23.67 26.03,23.67 24.89,22.53 24.89,21.39 19.18,15.67 19.18,2.84 H9.3
PD9: length 107.4
  Inner1 w0.254: H8.3 45.97,2.84 45.97,7.93 49.06,11.02 54.27,11.02 60.78,17.54 60.78,69.57 64.67,73.46 88.14,73.46 H1.9
PD10: length 173.1
  Top Layer w0.254: v1(75.18,80.7) 83.06,80.7 85.98,77.78 89.92,77.78 91.19,76.5
  Inner1 w0.254: H9.2 17.91,24.82 19.71,26.62 46.71,26.62 48.89,24.44 53.47,24.44 54.61,25.58 54.61,88.44 58.29,92.13 74.17,92.13 75.18,91.11 v1(75.18,80.7)
PD11: length 114.4
  Inner1 w0.254: H8.2 44.7,7.17 48.92,11.38 54.12,11.38 60.43,17.68 60.43,76.87 62.25,78.69 71.73,78.69 76.58,73.84 79.12,73.84 81.79,76.5 H1.7
PD12: length 174.9
  Inner1 w0.254: 91.19,79.05 92.46,80.31 92.46,88.57 88.52,92.51 58.17,92.51 54.23,88.57 54.23,27.99 53.21,26.97 19.56,26.97 16,23.42 16,3.48 H9.1
PD13: length 115.4
  Inner1 w0.254: H8.1 43.31,2.97 43.31,6.27 48.77,11.74 53.98,11.74 60.07,17.83 60.07,77.01 62.1,79.05 H1.5
PD14: length 90.7
  Inner1 w0.254: H1.15 70.61,66.34 61.85,57.58 61.85,17.09 61.7,16.94 61.7,16.92 54.73,9.96 51.69,9.96 49.78,8.05 H8.6
PD15: length 175.7
  Inner1 w0.254: v1(72.64,80.7) 72.64,89.2 70.82,91.03 59.23,91.03 55.75,87.55 55.75,18.34 54.23,16.81 47.75,16.81 45.85,18.72 25.91,18.72 21.72,14.53 21.72,2.84 H9.5
  Bottom Layer w0.254: v1(72.64,80.7) 72.64,78.03 77.09,73.58 85.47,73.58 86.23,72.82 86.23,69.14 87.76,67.62 89.92,67.62 91.19,66.34
PE0: length 84.2
  Inner1 w0.254: H2.41 45.21,38.28 45.21,50.85 37.08,58.98 35.31,58.98 19.69,74.6 19.69,81.71 7.11,94.28 7.11,96.83 5.84,98.09
PE1: length 74.7
  Inner2 w0.254: 33.02,98.09 31.75,96.83 31.75,71.3 30.61,70.16 30.61,54.03 47.5,37.14 51.43,37.14 52.7,35.87
PE2: length 57.2
  Top Layer w0.254: H10.20 7.37,8.81 10.29,11.74 10.29,19.48 11.56,20.75 23.24,20.75 26.16,23.67 42.16,23.67 v1(43.82,25.32)
  Bottom Layer w0.254: v1(43.82,25.32) 46.74,28.25 H2.45
PE3: length 63.2
  Top Layer w0.254: v1(42.93,28.5) 41.78,29.64 11.81,29.64 8.64,26.47 8.64,14.4 H10.18
  Inner1 w0.254: H2.46 51.43,29.52 49.15,29.52 48.13,28.5 v1(42.93,28.5)
PE4: length 49.6
  Inner2 w0.254: 50.17,25.71 46.23,29.64 26.03,29.64 25.27,30.4 4.32,30.4 H10.1
PE5: length 52.1
  Inner2 w0.254: H10.3 4.32,27.86 25.02,27.86 25.91,26.97 46.36,26.97 48.89,24.44 51.43,24.44 52.7,25.71
PE6: length 49.2
  Inner2 w0.254: H2.49 49.53,23.8 25.78,23.8 23.5,26.09 20.57,26.09 19.81,25.32 4.32,25.32 H10.5
PE7: length 70.5
  Inner1 w0.254: H1.29 70.61,48.56 64.52,42.47 64.52,16.18 58.67,10.34 58.67,2.84 H8.13
PE8: length 91.2
  Inner2 w0.254: 91.19,48.56 89.92,49.84 80.77,49.84 76.51,45.57 76.51,29.58 76.45,29.55 76.45,29.53 57.23,10.31 57.13,10.31 57.12,10.31 36.29,10.31 34.42,8.44 34.42,2.84 H9.15
PE9: length 91.4
  Inner2 w0.254: 91.19,51.11 89.92,52.38 80.47,52.38 76.15,48.06 76.15,29.73 76.07,29.66 76.07,29.66 57.08,10.67 56.97,10.67 56.97,10.67 36.14,10.67 33.15,7.67 H9.14
PE10: length 70.5
  Inner1 w0.254: H8.12 57.4,9.59 64.14,16.32 64.14,44.63 70.61,51.11 H1.27
PE11: length 98.2
  Inner2 w0.254: 91.19,53.64 89.92,54.92 79.25,54.92 75.79,51.46 75.79,29.88 56.94,11.02 35.98,11.02 31.88,6.92 31.88,2.84 H9.13
PE12: length 76.6
  Inner1 w0.254: H1.25 70.61,53.64 63.75,46.79 63.75,16.44 56.13,8.82 56.13,2.84 H8.11
PE13: length 98.4
  Inner2 w0.254: H9.12 30.61,6.15 35.83,11.38 56.79,11.38 75.44,30.03 75.44,53.9 78.99,57.45 89.92,57.45 91.19,56.19
PE14: length 76.6
  Inner1 w0.254: H1.23 70.61,56.19 63.37,48.95 63.37,16.57 54.86,8.06 H8.10
PE15: length 104.7
  Inner2 w0.254: 91.19,58.73 89.92,60 78.74,60 75.06,56.31 75.06,30.15 56.64,11.74 35.69,11.74 29.34,5.38 29.34,2.84 H9.11
PF2: length 53.9
  Inner2 w0.254: H10.15 4.32,12.62 24.38,12.62 25.91,11.1 31.11,11.1 33.15,13.13 42.55,13.13 v1(42.8,12.88)
  Bottom Layer w0.254: v1(42.8,12.88) 44.2,12.88 48.13,16.81 51.43,16.81 H2.54
PF3: length 48.5
  Inner2 w0.254: H10.11 4.32,17.7 24.89,17.7 26.29,16.31 49.4,16.31 50.17,15.55
PF4: length 85.3
  Top Layer w0.254: v1(46.36,25.07) 44.45,26.97 25.78,26.97 23.62,29.13 12.32,29.13 9.4,26.21 9.4,12.62 6.86,10.08 4.32,10.08 H10.17
  Inner2 w0.254: v1(56.9,25.45) 56.9,21.13 55.24,19.48 55.24,16.56 54.23,15.55 52.7,15.55
  Bottom Layer w0.254: v1(46.36,25.07) 46.99,24.44 56.13,24.44 56.9,25.2 v1(56.9,25.45)
PF5: length 49.2
  Inner2 w0.254: H2.57 49.28,13.89 43.69,13.89 43.05,14.53 32.13,14.53 31.37,13.77 25.91,13.77 24.51,15.16 4.32,15.16 H10.13
PF6: length 54.3
  Top Layer w0.254: H10.19 4.57,7.29 7.87,7.29 14.22,13.64 28.96,13.64 30.35,12.24 40.01,12.24 40.64,11.61 51.31,11.61 H2.58
PF10: length 71.4
  Inner2 w0.254: v1(69.98,18.09) H1.53
  Bottom Layer w0.254: H9.9 26.8,2.84 26.8,5.38 32.13,10.72 53.09,10.72 60.45,18.09 v1(69.98,18.09)
PF11: length 77.3
  Inner2 w0.254: 91.19,40.95 89.92,42.22 81.15,42.22 77.72,38.79 77.72,29.01 57.7,8.99 39.16,8.99 38.23,8.05 H9.18
PF12: length 64.4
  Inner1 w0.254: H1.33 70.61,43.48 65.28,38.15 65.28,15.93 61.21,11.86 61.21,2.84 H8.15
PF13: length 73.3
  Inner2 w0.254: H1.45 77.72,28.25 69.21,19.74 69.21,17.7 v1(69.98,16.94)
  Bottom Layer w0.254: v1(69.98,16.94) 60.33,16.94 53.59,10.21 34.16,10.21 H9.10
PF14: length 130.9
  Top Layer w0.254: v1(58.17,46.66) 65.53,46.66 80.14,32.06 91.82,32.06 93.47,30.4 93.47,26.85 92.33,25.71 91.19,25.71 ; v1(56.77,16.81) 48.89,16.81 48.51,17.2 v1(37.72,17.2)
  Inner1 w0.254: v1(56.77,16.81) 58.17,18.21 v1(58.17,46.66)
  Bottom Layer w0.254: v1(37.72,17.2) 36.07,18.85 5.72,18.85 H10.12
PF15: length 83.7
  Inner2 w0.254: H9.17 36.96,2.84 36.96,8.05 38.25,9.34 57.55,9.34 77.34,29.13 77.34,40.56 81.53,44.75 89.92,44.75 91.19,43.48
PG0: length 64.4
  Inner1 w0.254: H8.14 59.94,11.1 64.9,16.05 64.9,40.31 70.61,46.03 88.65,46.03
PG1: length 85
  Inner2 w0.254: 36.57,9.96 35.69,9.07 H9.16 ; 91.19,46.03 89.92,47.3 81.03,47.3 76.96,43.23 76.96,29.28 57.9,10.22 57.65,10.22 57.37,9.95 57.15,9.96 ; 36.58,9.96 57.15,9.96
PG2: length 90.4
  Inner1 w0.254: 88.65,63.81 70.61,63.81 62.23,55.42 62.23,16.94 54.86,9.58 52.32,9.58 51.05,8.31 51.05,2.84 H8.7
PG3: length 167.9
  Inner1 w0.254: H9.6 22.99,13.26 25.91,16.18 46.99,16.18 48.89,14.28 53.98,14.28 56.13,16.43 56.13,84.51 59.44,87.81 70.74,87.81 71.76,86.79 v1(71.76,80.7)
  Bottom Layer w0.254: 91.19,63.81 89.92,65.08 87.38,65.08 85.88,66.57 85.88,72.29 84.94,73.23 76.94,73.23 72.29,77.88 72.29,80.16 v1(71.76,80.7)
PG4: length 83.7
  Inner1 w0.254: H1.19 70.61,61.27 62.61,53.26 62.61,16.81 54.99,9.19 53.47,9.19 52.32,8.05 H8.8
PG5: length 25.5
  Inner2 w0.254: H2.8 51.43,77.78 49.4,77.78 48.51,78.66 48.51,85.52 49.53,86.54 49.53,96.83 50.8,98.09
PG6: length 34.3
  Inner1 w0.254: H2.7 47.24,79.43 38.1,79.43 27.71,89.82 27.71,94.01 H11.2
PG7: length 24.7
  Inner2 w0.254: H12.6 48.13,95.43 48.13,76.5 49.4,75.23 51.43,75.23 H2.10
PG8: length 39.3
  Inner1 w0.254: H2.9 43.06,73.97 27.36,89.67 27.36,91.82 24.89,94.28 24.89,96.83 23.62,98.09
PG9: length 62.2
  Inner1 w0.254: H2.29 47.24,51.49 47.24,61.27 13.46,95.05 H11.12
PG10: length 61.1
  Inner2 w0.254: 38.1,98.09 36.83,96.83 36.83,71.55 34.54,69.27 34.54,67.11 35.05,66.6 36.96,66.6 37.34,66.22 37.34,61.52 48.89,49.96 51.31,49.96 H2.30
PG11: length 69.3
  Inner1 w0.254: 10.92,98.09 12.19,96.83 12.19,94.28 46.74,59.74 46.74,47.8 48.51,46.03 50.17,46.03
PG12: length 82.2
  Inner2 w0.254: H2.44 52.45,30.78 51.18,32.06 45.72,32.06 27.69,50.09 27.69,69.9 28.96,71.17 28.96,96.57 30.48,98.09
PG13: length 85.1
  Inner1 w0.254: H2.43 44.83,36.12 44.83,49.45 37.85,56.44 34.42,56.44 33.15,57.71 33.15,60.63 19.3,74.47 19.3,81.59 5.84,95.05 H11.18
PG14: length 75
  Inner2 w0.254: H2.42 51.43,34.59 46.99,34.59 29.34,52.25 29.34,70.03 30.48,71.17 H12.20
PG15: length 61.7
  Inner2 w0.254: 35.56,95.56 35.56,71.55 33.27,69.27 33.27,60 34.29,58.98 37.72,58.98 49.4,47.3 51.31,47.3 52.58,46.03 52.7,46.03
UPT1_RX_PA0: length 19
  Top Layer w0.254: H6.2 76.2,13.39 85.98,23.16 H1.49
UPT1_TX_PA1: length 19
  Top Layer w0.254: 91.19,23.16 89.92,21.9 87.25,21.9 85.47,20.12 85.47,17.58 H6.3
GND: length 24.2
  Bottom Layer w0.508: H4.4 H4.1 88.65,84.89 H1.1 ; H1.1 H1.3 91.19,81.59 ; H1.1 91.19,84.12 91.19,82.19
BLDC1_PF7: length 100.1
  Top Layer w0.254: H7.1 29.34,51.36 35.94,44.75 65.66,44.75 85.98,24.44 93.47,24.44 94.11,23.8 94.11,21.26 93.47,20.62 91.19,20.62
BLDC2_PB14: length 97.6
  Top Layer w0.254: H7.2 9.65,48.82 9.53,48.69 8.64,49.58 8.64,53.01 28.26,72.63 89.98,72.63 91.19,71.42

## Copper pours and planes (outline as drawn; the poured copper is in the pictures)
GND on Top Layer: 0,100 100,100 100,0 0,0
GND on Bottom Layer: 0,100 100,100 100,0 0,0
GND on Inner1: 0,100 100,100 100,0 0,0
GND on Inner2: 0,100 100,100 100,0 0,0

## Text on the board
Top Silkscreen Layer: GND | G13 | E0 | PF4 | PE4 | PE5 | PE6 | PA15 | PC13 | PF3 | PF5 | PF6 | PF2 | B5 | B9 | G11 | B3 | PC4 | PA4 | PC5 | PF14 | PC0 | PC2 | PE3 | PE2 | PA6 | PB1 | D6 | G9 | PF7 | PB14 | PF8 | PF9 | D0 | D4 | D10 | D12 | C11 | A8 | 2 | 3 | 4 | 1 | B12 | D8 | C9 | A9 | D15 | G3 | G8 | C7 | C3 | B11 | A11 | G6 | F13 | F10 | 3.3V | XDA | XCL | INT | PB6 | PB7 | G12 | G14 | SDD | CSB | PF0 | PF1 | E13 | E15 | PC12 | AUX | MD1 | MD0 | PD2 | 5V | E1 | B8 | E11 | E9 | B4 | G15 | G1 | E8 | G10 | F11 | F15 | D7 | D5 | D3 | A2 | C1 | C10 | D1 | D11 | D13 | A10 | C8 | B15 | D9 | C6 | G7 | D14 | B13 | A12 | G5 | G4 | G2 | E14 | B10 | E10 | E12 | G0 | E7 | F12 | B2 | A5 | A7 | A3 | B0 | PA1 | PA0
